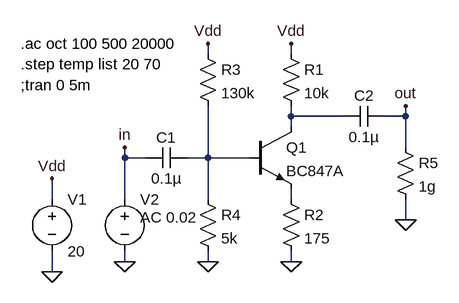
[diagram p0: schematic bjt-amplifier-2.asc]
bjt-amplifier-2.asc, the LTspice schematic file:
Version 4
SHEET 1 880 680
WIRE -560 -304 -560 -320
WIRE -432 -304 -432 -320
WIRE -432 -208 -432 -224
WIRE -352 -208 -432 -208
WIRE -256 -208 -256 -224
WIRE -256 -208 -288 -208
WIRE -432 -192 -432 -208
WIRE -256 -160 -256 -208
WIRE -688 -144 -688 -160
WIRE -656 -144 -688 -144
WIRE -560 -144 -560 -224
WIRE -560 -144 -592 -144
WIRE -496 -144 -560 -144
WIRE -800 -80 -800 -112
WIRE -688 -80 -688 -144
WIRE -560 -80 -560 -144
WIRE -432 -80 -432 -96
WIRE -256 -48 -256 -80
WIRE -688 16 -688 0
WIRE -560 16 -560 0
WIRE -432 16 -432 0
WIRE -800 32 -800 0
FLAG -800 32 0
FLAG -800 -112 Vdd
FLAG -432 16 0
FLAG -432 -320 Vdd
FLAG -560 -320 Vdd
FLAG -560 16 0
FLAG -688 16 0
FLAG -256 -48 0
FLAG -256 -224 out
FLAG -688 -160 in
SYMBOL voltage -800 -96 R0
WINDOW 123 0 0 Left 2
WINDOW 39 0 0 Left 2
SYMATTR InstName V1
SYMATTR Value 20
SYMBOL npn -496 -192 R0
SYMATTR InstName Q1
SYMATTR Value BC847A
SYMBOL res -448 -320 R0
SYMATTR InstName R1
SYMATTR Value 10k
SYMBOL res -448 -96 R0
SYMATTR InstName R2
SYMATTR Value 175
SYMBOL res -576 -320 R0
SYMATTR InstName R3
SYMATTR Value 130k
SYMBOL res -576 -96 R0
SYMATTR InstName R4
SYMATTR Value 5k
SYMBOL cap -592 -160 R90
WINDOW 0 0 32 VBottom 2
WINDOW 3 32 32 VTop 2
SYMATTR InstName C1
SYMATTR Value 0.1µ
SYMBOL voltage -688 -96 R0
WINDOW 39 0 0 Left 2
WINDOW 3 24 72 Invisible 2
WINDOW 123 24 44 Left 2
SYMATTR Value SINE(0 0.02 1000)
SYMATTR Value2 AC 0.02
SYMATTR InstName V2
SYMBOL cap -288 -224 R90
WINDOW 0 0 32 VBottom 2
WINDOW 3 32 32 VTop 2
SYMATTR InstName C2
SYMATTR Value 0.1µ
SYMBOL res -272 -176 R0
SYMATTR InstName R5
SYMATTR Value 1g
TEXT -848 -320 Left 2 !.ac oct 100 500 20000
TEXT -848 -288 Left 2 !.step temp list 20 70
TEXT -848 -256 Left 2 !;tran 0 5m

The netlist it stands for:
* bjt-amplifier-2.asc
V1 Vdd 0 20
Q1 N001 N002 N003 0 BC847A
R1 Vdd N001 10k
R2 N003 0 175
R3 Vdd N002 130k
R4 N002 0 5k
C1 N002 in 0.1µ
V2 in 0 SINE(0 0.02 1000) AC 0.02
C2 out N001 0.1µ
R5 out 0 1g
.model NPN NPN
.model PNP PNP
.lib standard.bjt
.ac oct 100 500 20000
.step temp list 20 70
;tran 0 5m
.backanno
.end